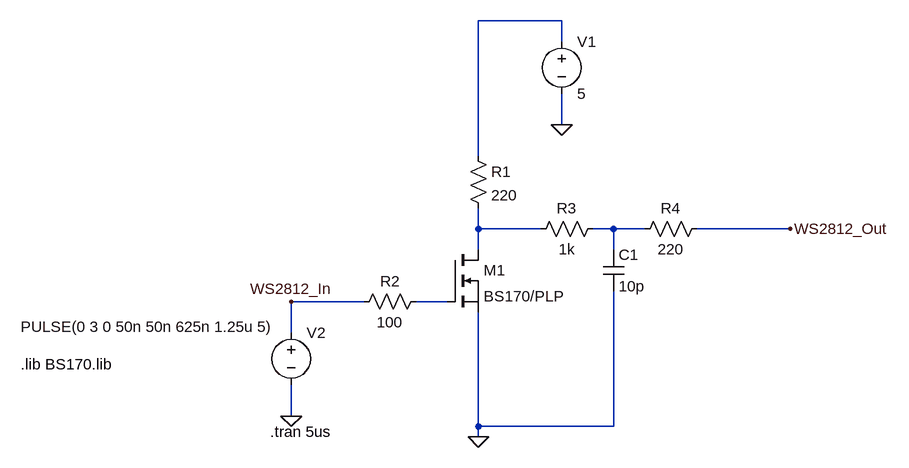
[diagram p0: schematic WS2812_LevelShifter.asc]
WS2812_LevelShifter.asc, the LTspice schematic file:
Version 4
SHEET 1 880 680
WIRE -64 -672 -192 -672
WIRE -64 -640 -64 -672
WIRE -64 -512 -64 -560
WIRE -192 -464 -192 -672
WIRE -192 -352 -192 -384
WIRE -96 -352 -192 -352
WIRE 16 -352 -16 -352
WIRE 64 -352 16 -352
WIRE 288 -352 144 -352
WIRE -192 -320 -192 -352
WIRE 16 -320 16 -352
WIRE -368 -240 -480 -240
WIRE -240 -240 -288 -240
WIRE -480 -192 -480 -240
WIRE -480 -64 -480 -112
WIRE -192 -48 -192 -224
WIRE 16 -48 16 -256
WIRE 16 -48 -192 -48
WIRE -192 -32 -192 -48
FLAG -192 -32 0
FLAG -64 -512 0
FLAG -480 -64 0
FLAG -480 -240 WS2812_In
FLAG 288 -352 WS2812_Out
SYMBOL res -208 -480 R0
SYMATTR InstName R1
SYMATTR Value 220
SYMBOL res -272 -256 R90
WINDOW 0 0 56 VBottom 2
WINDOW 3 32 56 VTop 2
SYMATTR InstName R2
SYMATTR Value 100
SYMBOL res 0 -368 R90
WINDOW 0 0 56 VBottom 2
WINDOW 3 32 56 VTop 2
SYMATTR InstName R3
SYMATTR Value 1k
SYMBOL voltage -64 -656 R0
WINDOW 123 0 0 Left 2
WINDOW 39 0 0 Left 2
SYMATTR InstName V1
SYMATTR Value 5
SYMBOL voltage -480 -208 R0
WINDOW 3 -416 7 Left 2
WINDOW 123 0 0 Left 2
WINDOW 39 0 0 Left 2
SYMATTR Value PULSE(0 3 0 50n 50n 625n 1.25u 5)
SYMATTR InstName V2
SYMBOL nmos -240 -320 R0
SYMATTR InstName M1
SYMATTR Value BS170/PLP
SYMATTR Prefix X
SYMBOL cap 0 -320 R0
SYMATTR InstName C1
SYMATTR Value 10p
SYMBOL res 160 -368 R90
WINDOW 0 0 56 VBottom 2
WINDOW 3 32 56 VTop 2
SYMATTR InstName R4
SYMATTR Value 220
TEXT -512 -40 Left 2 !.tran 5us
TEXT -896 -144 Left 2 !.lib BS170.lib

The netlist it stands for:
* WS2812_LevelShifter.asc
R1 N001 N002 220
R2 N004 WS2812_In 100
R3 N003 N002 1k
V1 N001 0 5
V2 WS2812_In 0 PULSE(0 3 0 50n 50n 625n 1.25u 5)
XM1 N002 N004 0 BS170/PLP  ; pins D G S
C1 N003 0 10p
R4 WS2812_Out N003 220
.tran 5us
.lib BS170.lib
.backanno
.end

* Results of the author's LTspice run, read from the files saved beside the schematic
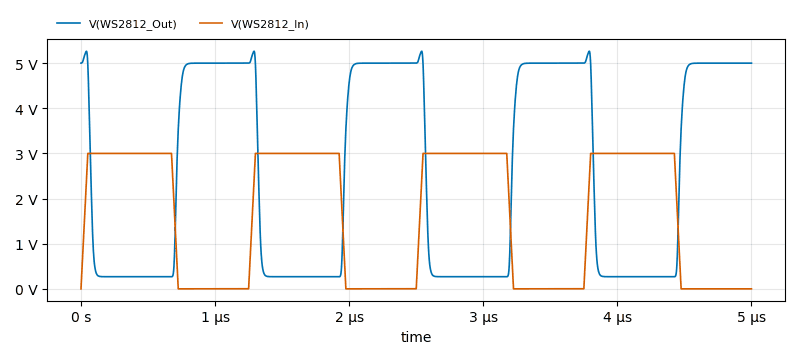
[diagram p1: Transient Analysis of WS2812_LevelShifter.asc, plotted from the saved traces]
* Transient Analysis, 1 run:
*   V(WS2812_Out): min 268.8 mV, max 5.264 V, average 2.566 V, rms 3.442 V, last 5 V
*   V(WS2812_In): min 0 V, max 3 V, average 1.62 V, rms 2.177 V, last 0 V